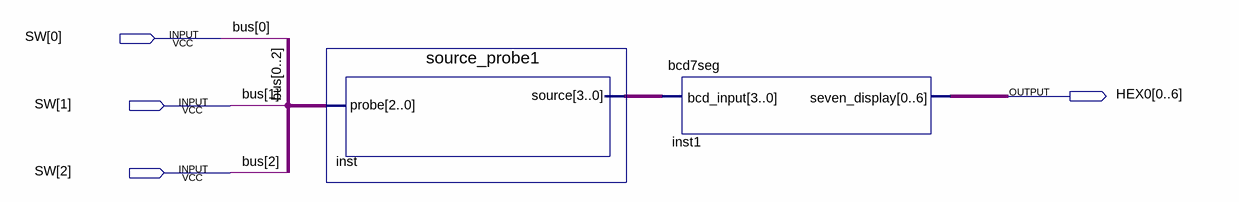
[diagram p0: schematic sheet]
// Quartus schematic Laboration2.bdf as structural Verilog: 2 symbols, 4 pins
module Laboration2 (
  input  [2:0] SW,
  output [0:6] HEX0
);

  wire [3:0] inst_source;

  source_probe1 inst (.probe({SW[0], SW[1], SW[2]}), .source(inst_source));
  bcd7seg inst1 (.bcd_input(inst_source), .seven_display(HEX0));

  // Other names for the same wires on the sheet: bus[2:0] = SW
endmodule
